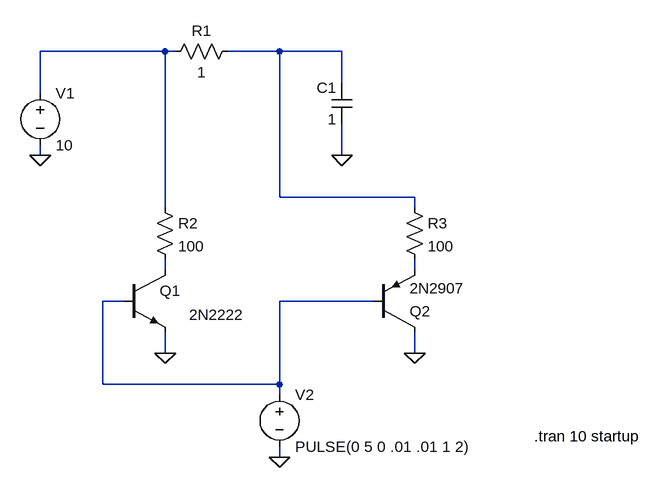
[diagram p0: schematic prepaAstable.asc]
prepaAstable.asc, the LTspice schematic file:
Version 4
SHEET 1 1096 680
WIRE 352 0 160 0
WIRE 368 0 352 0
WIRE 528 0 448 0
WIRE 624 0 528 0
WIRE 624 48 624 0
WIRE 160 64 160 0
WIRE 160 160 160 144
WIRE 624 160 624 112
WIRE 528 224 528 0
WIRE 736 224 528 224
WIRE 352 240 352 0
WIRE 736 240 736 224
WIRE 352 336 352 320
WIRE 736 336 736 320
WIRE 288 384 256 384
WIRE 672 384 528 384
WIRE 352 464 352 432
WIRE 736 464 736 432
WIRE 256 512 256 384
WIRE 528 512 528 384
WIRE 528 512 256 512
WIRE 528 528 528 512
WIRE 528 624 528 608
FLAG 528 624 0
FLAG 736 464 0
FLAG 352 464 0
FLAG 624 160 0
FLAG 160 160 0
SYMBOL npn 288 336 R0
WINDOW 3 101 69 Left 2
SYMATTR Value 2N2222
SYMATTR InstName Q1
SYMBOL voltage 160 48 R0
SYMATTR InstName V1
SYMATTR Value 10
SYMBOL voltage 528 512 R0
SYMATTR InstName V2
SYMATTR Value PULSE(0 5 0 .01 .01 1 2)
SYMBOL res 464 -16 R90
WINDOW 0 0 56 VBottom 2
WINDOW 3 32 56 VTop 2
SYMATTR InstName R1
SYMATTR Value 1
SYMBOL cap 640 112 R180
WINDOW 0 24 56 Left 2
WINDOW 3 24 8 Left 2
SYMATTR InstName C1
SYMATTR Value 1
SYMBOL pnp 672 432 M180
SYMATTR InstName Q2
SYMATTR Value 2N2907
SYMBOL res 336 224 R0
SYMATTR InstName R2
SYMATTR Value 100
SYMBOL res 720 224 R0
SYMATTR InstName R3
SYMATTR Value 100
TEXT 920 592 Left 2 !.tran 10 startup

The netlist it stands for:
* prepaAstable.asc
Q1 N003 N005 0 0 2N2222
V1 N001 0 10
V2 N005 0 PULSE(0 5 0 .01 .01 1 2)
R1 N002 N001 1
C1 0 N002 1
Q2 0 N005 N004 0 2N2907
R2 N001 N003 100
R3 N002 N004 100
.model NPN NPN
.model PNP PNP
.lib standard.bjt
.tran 10 startup
.backanno
.end